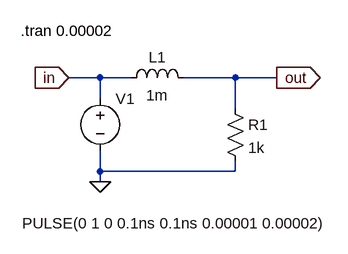
[diagram p0: schematic exp3.asc]
exp3.asc, the LTspice schematic file:
Version 4
SHEET 1 880 680
WIRE 112 -272 64 -272
WIRE 160 -272 112 -272
WIRE 320 -272 240 -272
WIRE 384 -272 320 -272
WIRE 112 -240 112 -272
WIRE 320 -224 320 -272
WIRE 112 -128 112 -160
WIRE 320 -128 320 -144
WIRE 320 -128 112 -128
WIRE 112 -112 112 -128
FLAG 64 -272 in
IOPIN 64 -272 In
FLAG 384 -272 out
IOPIN 384 -272 Out
FLAG 112 -112 0
SYMBOL ind 144 -256 R270
WINDOW 0 32 56 VTop 2
WINDOW 3 5 56 VBottom 2
SYMATTR InstName L1
SYMATTR Value 1m
SYMBOL res 304 -240 R0
SYMATTR InstName R1
SYMATTR Value 1k
SYMBOL voltage 112 -256 R0
WINDOW 3 -120 208 Left 2
WINDOW 123 0 0 Left 0
WINDOW 39 0 0 Left 0
SYMATTR InstName V1
SYMATTR Value PULSE(0 1 0 0.1ns 0.1ns 0.00001 0.00002)
TEXT -10 -344 Left 2 !.tran 0.00002

The netlist it stands for:
* exp3.asc
L1 in out 1m
R1 out 0 1k
V1 in 0 PULSE(0 1 0 0.1ns 0.1ns 0.00001 0.00002)
.tran 0.00002
.backanno
.end